# Altium schematic sheet ПП 2.SchDoc
size 209 x 297 mm; SheetNumber: 2; Обозначение: СФ МЭИ ПЭ2-18 11.03.04 03
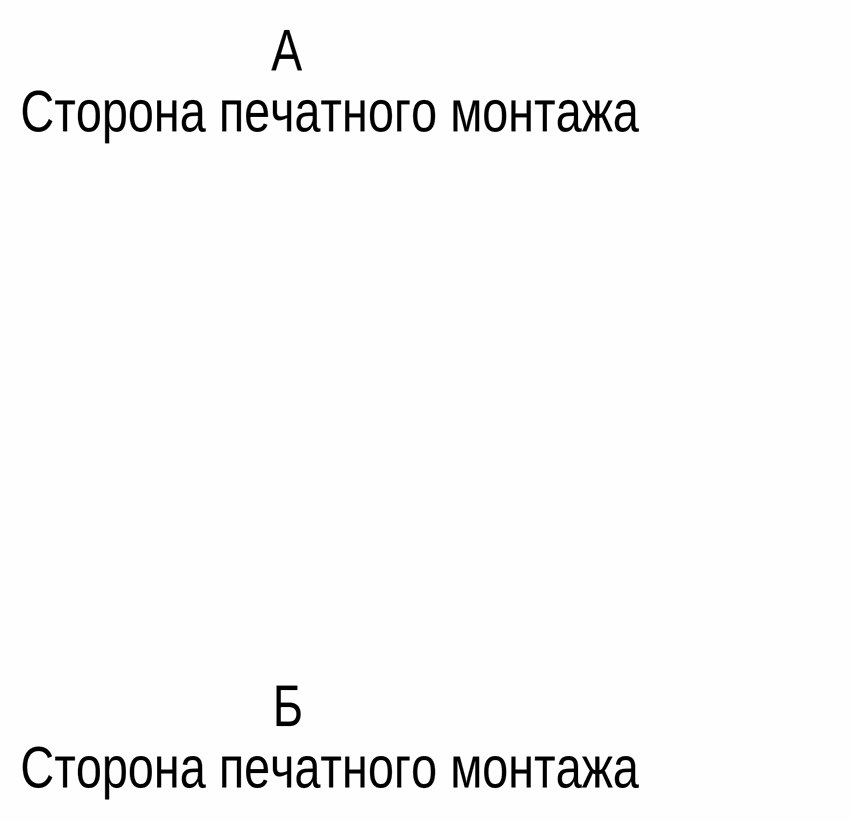
[diagram p0: ПП 2.SchDoc]

## Notes on the sheet
- A
- Сторона печатного монтажа
- Б
- Подп. и дата
- Инв. № дубл.
- Взам. инв. №
- Инв. № подл.
- Изм.
- Лист
- № докум.
- Подп.
- Дата
- Копировал
- Формат А4